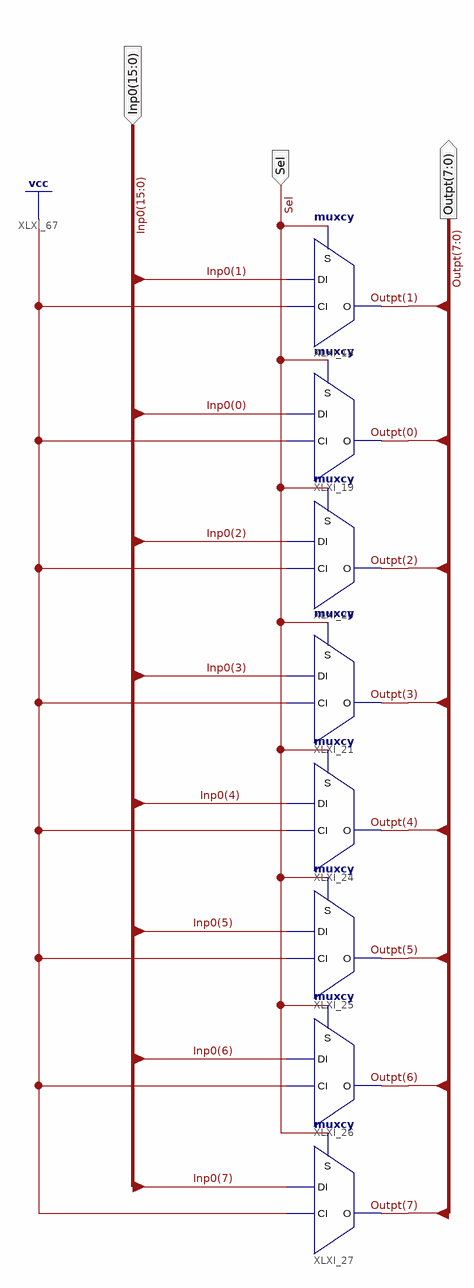
[diagram p0: schematic sheet 1]
// Xilinx ISE schematic OCR_8.sch (spartan3e) as structural Verilog: 8 symbols, 3 ports
module OCR_8 (
  input  Sel,
  input  [15:0] Inp0,
  output [7:0] Outpt
);

  muxcy XLXI_19 (.CI(1'b1), .DI(Inp0[0]), .S(Sel), .O(Outpt[0]));
  muxcy XLXI_18 (.CI(1'b1), .DI(Inp0[1]), .S(Sel), .O(Outpt[1]));
  muxcy XLXI_20 (.CI(1'b1), .DI(Inp0[2]), .S(Sel), .O(Outpt[2]));
  muxcy XLXI_21 (.CI(1'b1), .DI(Inp0[3]), .S(Sel), .O(Outpt[3]));
  muxcy XLXI_24 (.CI(1'b1), .DI(Inp0[4]), .S(Sel), .O(Outpt[4]));
  muxcy XLXI_25 (.CI(1'b1), .DI(Inp0[5]), .S(Sel), .O(Outpt[5]));
  muxcy XLXI_26 (.CI(1'b1), .DI(Inp0[6]), .S(Sel), .O(Outpt[6]));
  muxcy XLXI_27 (.CI(1'b1), .DI(Inp0[7]), .S(Sel), .O(Outpt[7]));
endmodule
